# EAGLE design max128 (EAGLE 7.3.0)
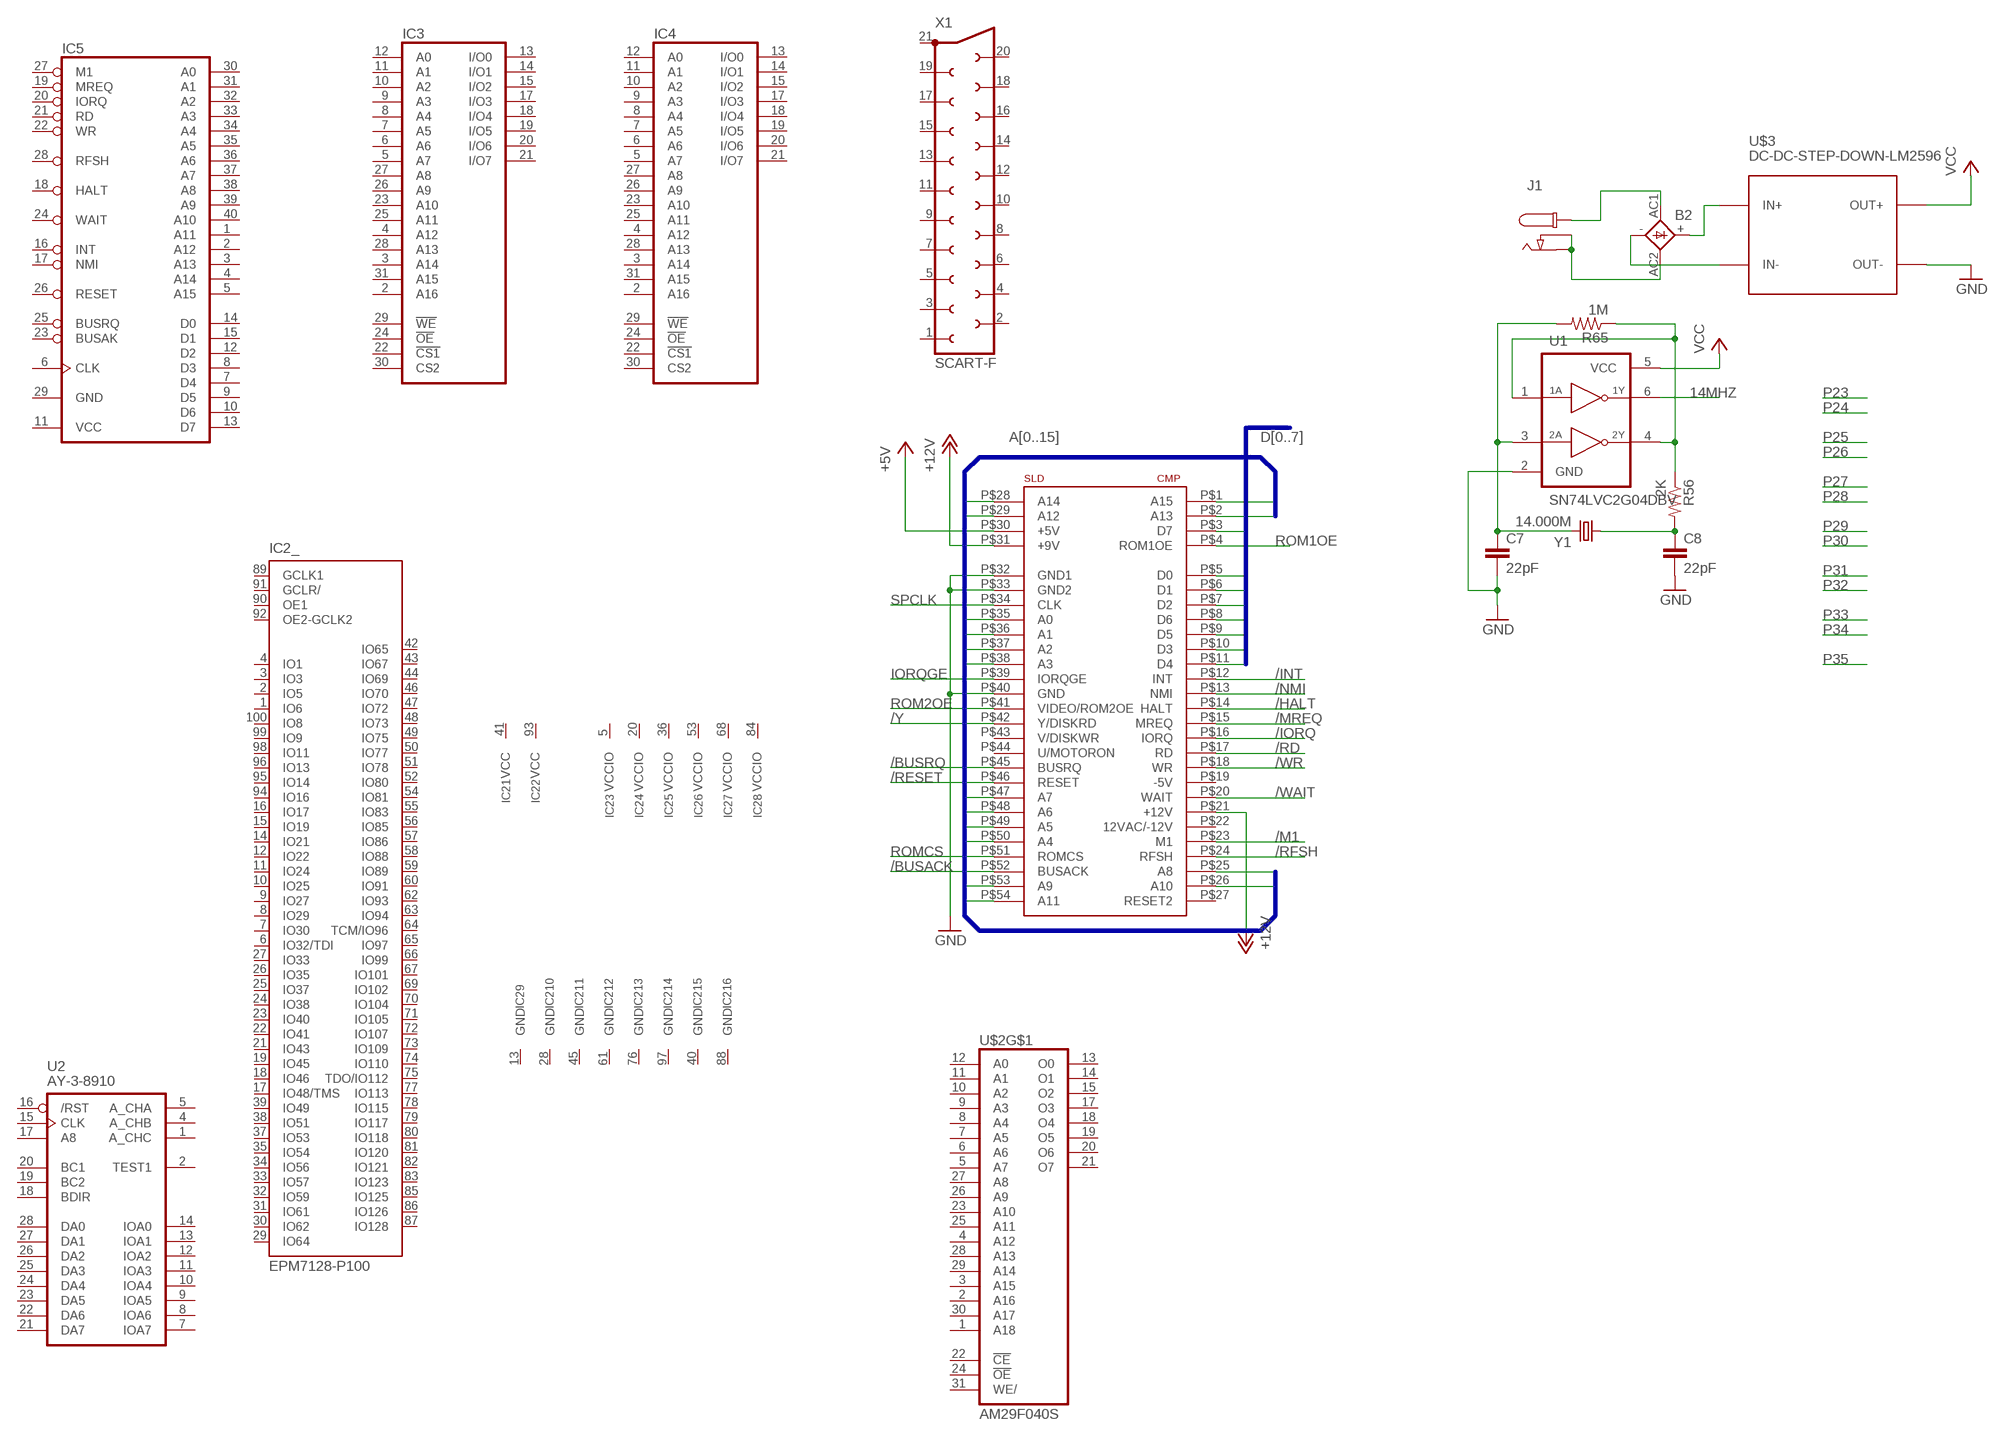
[diagram p0: schematic, sheet 1]

## Parts
B2  1KAB  [1KAB]
C7  22pF  C-EUC0805K  [C0805K]
C8  22pF  C-EUC0805K  [C0805K]
IC2  EPM7128-P100  [PQFP100]
IC3  LP621024CM  [SOP32L]
IC4  LP621024CM  [SOP32L]
IC5  Z80CPU  [DIL40]
J1  CON_DC_M-DC_PTH2  [DC_BARREL_JACK_PTH_2MM_2]
R56  2K  R-US_R0805  [R0805]
R65  1M  R-US_R0805  [R0805]
U1  SN74LVC2G04DBV  [SOT23-6]
U2  AY-3-8910  [DIL28-6]
U$1  CONECTOR_EDGE_LADO_SPECTRUM  [CONECTOR_LADO_SPECTRUM]
U$2  AM29F040S  [PLCC-SR32]
U$3  DC-DC-STEP-DOWN-LM2596  [DC-DC-STEP-DOWN-LM2596]
X1  SCART-F  [SCART-F]
Y1  14.000M  CRYSTALHC49S  [HC49/S]

## Nets
14MHZ: U1.6(1Y)
+5V [power]: U$1.P$30(+5V)
+12V [power]: U$1.P$21(+12V) U$1.P$31(+9V)
/BUSACK: U$1.P$52(BUSACK)
/BUSRQ: U$1.P$45(BUSRQ)
/HALT [power]: U$1.P$14(HALT)
/INT: U$1.P$12(INT)
/IORQ: U$1.P$16(IORQ)
/M1: U$1.P$23(M1)
/MREQ: U$1.P$15(MREQ)
/NMI: U$1.P$13(NMI)
/RD: U$1.P$17(RD)
/RESET: U$1.P$46(RESET)
/RFSH [power]: U$1.P$24(RFSH)
/WAIT: U$1.P$20(WAIT)
/WR: U$1.P$18(WR)
/Y: U$1.P$42(Y/DISKRD)
A0: U$1.P$35(A0)
A1: U$1.P$36(A1)
A2: U$1.P$37(A2)
A3: U$1.P$38(A3)
A4: U$1.P$50(A4)
A5: U$1.P$49(A5)
A6: U$1.P$48(A6)
A7: U$1.P$47(A7)
A8: U$1.P$25(A8)
A9: U$1.P$53(A9)
A10: U$1.P$26(A10)
A11: U$1.P$54(A11)
A12: U$1.P$29(A12)
A13: U$1.P$2(A13)
A14: U$1.P$28(A14)
A15: U$1.P$1(A15)
D0: U$1.P$5(D0)
D1: U$1.P$6(D1)
D2: U$1.P$7(D2)
D3: U$1.P$10(D3)
D4: U$1.P$11(D4)
D5: U$1.P$9(D5)
D6: U$1.P$8(D6)
D7: U$1.P$3(D7)
GND [power]: C7.2 C8.2 U1.2(GND) U$1.P$32(GND1) U$1.P$33(GND2) U$1.P$40(GND) U$3.OUT-
IORQGE: U$1.P$39(IORQGE)
N$1: B2.AC1 J1.P1
N$2: B2.AC2 J1.P2(P3) J1.P3(P2)
N$3: B2.+ U$3.IN+
N$4: B2.- U$3.IN-
N$24: C7.1 R65.2 U1.3(2A) Y1.2
N$27: R56.1 R65.1 U1.1(1A) U1.4(2Y)
N$61: C8.1 R56.2 Y1.1
ROM1OE: U$1.P$4(ROM1OE)
ROM2OE: U$1.P$41(VIDEO/ROM2OE)
ROMCS: U$1.P$51(ROMCS)
SPCLK: U$1.P$34(CLK)
VCC: U1.5(VCC) U$3.OUT+
Unconnected: IC2.1(_:IO6) IC2.2(_:IO5) IC2.3(_:IO3) IC2.4(_:IO1) IC2.6(_:IO32/TDI) IC2.7(_:IO30) IC2.8(_:IO29) IC2.9(_:IO27) IC2.10(_:IO25) IC2.11(_:IO24) IC2.12(_:IO22) IC2.14(_:IO21) IC2.15(_:IO19) IC2.16(_:IO17) IC2.17(_:IO48/TMS) IC2.18(_:IO46) IC2.19(_:IO45) IC2.21(_:IO43) IC2.22(_:IO41) IC2.23(_:IO40) IC2.24(_:IO38) IC2.25(_:IO37) IC2.26(_:IO35) IC2.27(_:IO33) IC2.29(_:IO64) IC2.30(_:IO62) IC2.31(_:IO61) IC2.32(_:IO59) IC2.33(_:IO57) IC2.34(_:IO56) IC2.35(_:IO54) IC2.37(_:IO53) IC2.38(_:IO51) IC2.39(_:IO49) IC2.42(_:IO65) IC2.43(_:IO67) IC2.44(_:IO69) IC2.46(_:IO70) IC2.47(_:IO72) IC2.48(_:IO73) IC2.49(_:IO75) IC2.50(_:IO77) IC2.51(_:IO78) IC2.52(_:IO80) IC2.54(_:IO81) IC2.55(_:IO83) IC2.56(_:IO85) IC2.57(_:IO86) IC2.58(_:IO88) IC2.59(_:IO89) IC2.60(_:IO91) IC2.62(_:IO93) IC2.63(_:IO94) IC2.64(_:TCM/IO96) IC2.65(_:IO97) IC2.66(_:IO99) IC2.67(_:IO101) IC2.69(_:IO102) IC2.70(_:IO104) IC2.71(_:IO105) IC2.72(_:IO107) IC2.73(_:IO109) IC2.74(_:IO110) IC2.75(_:TDO/IO112) IC2.77(_:IO113) IC2.78(_:IO115) IC2.79(_:IO117) IC2.80(_:IO118) IC2.81(_:IO120) IC2.82(_:IO121) IC2.83(_:IO123) IC2.85(_:IO125) IC2.86(_:IO126) IC2.87(_:IO128) IC2.89(_:GCLK1) IC2.90(_:OE1) IC2.91(_:GCLR/) IC2.92(_:OE2-GCLK2) IC2.94(_:IO16) IC2.95(_:IO14) IC2.96(_:IO13) IC2.98(_:IO11) IC2.99(_:IO9) IC2.100(_:IO8) IC3.1(NC) IC3.2(A16) IC3.3(A14) IC3.4(A12) IC3.5(A7) IC3.6(A6) IC3.7(A5) IC3.8(A4) IC3.9(A3) IC3.10(A2) IC3.11(A1) IC3.12(A0) IC3.13(I/O0) IC3.14(I/O1) IC3.15(I/O2) IC3.17(I/O3) IC3.18(I/O4) IC3.19(I/O5) IC3.20(I/O6) IC3.21(I/O7) IC3.22(!CS1) IC3.23(A10) IC3.24(!OE) IC3.25(A11) IC3.26(A9) IC3.27(A8) IC3.28(A13) IC3.29(!WE) IC3.30(CS2) IC3.31(A15) IC4.1(NC) IC4.2(A16) IC4.3(A14) IC4.4(A12) IC4.5(A7) IC4.6(A6) IC4.7(A5) IC4.8(A4) IC4.9(A3) IC4.10(A2) IC4.11(A1) IC4.12(A0) IC4.13(I/O0) IC4.14(I/O1) IC4.15(I/O2) IC4.17(I/O3) IC4.18(I/O4) IC4.19(I/O5) IC4.20(I/O6) IC4.21(I/O7) IC4.22(!CS1) IC4.23(A10) IC4.24(!OE) IC4.25(A11) IC4.26(A9) IC4.27(A8) IC4.28(A13) IC4.29(!WE) IC4.30(CS2) IC4.31(A15) IC5.1(A11) IC5.2(A12) IC5.3(A13) IC5.4(A14) IC5.5(A15) IC5.6(CLK) IC5.7(D4) IC5.8(D3) IC5.9(D5) IC5.10(D6) IC5.12(D2) IC5.13(D7) IC5.14(D0) IC5.15(D1) IC5.16(INT) IC5.17(NMI) IC5.18(HALT) IC5.19(MREQ) IC5.20(IORQ) IC5.21(RD) IC5.22(WR) IC5.23(BUSAK) IC5.24(WAIT) IC5.25(BUSRQ) IC5.26(RESET) IC5.27(M1) IC5.28(RFSH) IC5.30(A0) IC5.31(A1) IC5.32(A2) IC5.33(A3) IC5.34(A4) IC5.35(A5) IC5.36(A6) IC5.37(A7) IC5.38(A8) IC5.39(A9) IC5.40(A10) U2.1(A_CHC) U2.2(TEST1) U2.4(A_CHB) U2.5(A_CHA) U2.7(IOA7) U2.8(IOA6) U2.9(IOA5) U2.10(IOA4) U2.11(IOA3) U2.12(IOA2) U2.13(IOA1) U2.14(IOA0) U2.15(CLK) U2.16(/RST) U2.17(A8) U2.18(BDIR) U2.19(BC2) U2.20(BC1) U2.21(DA7) U2.22(DA6) U2.23(DA5) U2.24(DA4) U2.25(DA3) U2.26(DA2) U2.27(DA1) U2.28(DA0) U$1.P$19(-5V) U$1.P$22(12VAC/-12V) U$1.P$27(RESET2) U$1.P$43(V/DISKWR) U$1.P$44(U/MOTORON) U$2.1(A18) U$2.2(A16) U$2.3(A15) U$2.4(A12) U$2.5(A7) U$2.6(A6) U$2.7(A5) U$2.8(A4) U$2.9(A3) U$2.10(A2) U$2.11(A1) U$2.12(A0) U$2.13(O0) U$2.14(O1) U$2.15(O2) U$2.17(O3) U$2.18(O4) U$2.19(O5) U$2.20(O6) U$2.21(O7) U$2.22(!CE) U$2.23(A10) U$2.24(!OE) U$2.25(A11) U$2.26(A9) U$2.27(A8) U$2.28(A13) U$2.29(A14) U$2.30(A17) U$2.31(WE/) X1.1 X1.2 X1.3 X1.4 X1.5 X1.6 X1.7 X1.8 X1.9 X1.10 X1.11 X1.12 X1.13 X1.14 X1.15 X1.16 X1.17 X1.18 X1.19 X1.20 X1.21

## Buses
D[0..7]
A[0..15]

## Power pins joined to a net without a drawn wire
GND: IC2.13(9:GND) IC2.28(10:GND) IC2.40(15:GND) IC2.45(11:GND) IC2.61(12:GND) IC2.76(13:GND) IC2.88(16:GND) IC2.97(14:GND) IC3.16(GND) IC4.16(GND) IC5.29(GND) U2.6(GND) U$2.16(GND)
VCC: IC2.41(1:VCC) IC2.93(2:VCC) IC3.32(VCC) IC4.32(VCC) IC5.11(VCC) U2.3(VCC) U$2.32(VCC)
VCCIO: IC2.5(3:VCCIO) IC2.20(4:VCCIO) IC2.36(5:VCCIO) IC2.53(6:VCCIO) IC2.68(7:VCCIO) IC2.84(8:VCCIO)

## Library data of the parts
B2 = rectifier:1KAB: RECTIFIER grid 5,08 x 5,08 mm
C7 C8 = rcl:C-EU: CAPACITOR, European symbol
IC2 = altera:EPM7128-?100: EPM70128 MAX 7000 family; MPN: EPM7128SQC100-7N; OC_FARNELL: 1549424; OC_NEWARK: 51R0530
IC3 IC4 = memory:LP621024CM: MEMORY
IC5 = zilog:Z80CPU: Z80 FAMILY DEVICE
J1 = dp_devices:CON_DC_M: DC power connector
R56 R65 = rcl:R-US_: RESISTOR, American symbol
U1 = 74LV:SN74LVC2G04: DUAL INVERTER GATE
U2 = oldchips:AY-3-8910: Programmable sound generator
U$1 = zx_spectrum:CONECTOR_EDGE_LADO_SPECTRUM
U$2 = am29-memory:AM29F040S
U$3 = diy-modules:DC-DC-STEP-DOWN-LM2596: DC/DC Step-Down Regulator based on LM2596-ADJ chip LM2596 datasheet available here: http://www.ti.com/lit/ds/symlink/lm2596.pdf Click here to find device on ebay.com <http://www.ebay.com/sch/lm2596+power+regulator>
X1 = con-hirschmann:SCART-F: TV SCART CONNECTOR; OC_FARNELL: unknown; OC_NEWARK: unknown
Y1 = crystal:CRYSTAL: CRYSTAL; OC_FARNELL: 1667008; OC_NEWARK: unknown

## Net classes
1 power: width 0.305 mm, clearance 0.178 mm to class 0, clearance 0.229 mm

## Board
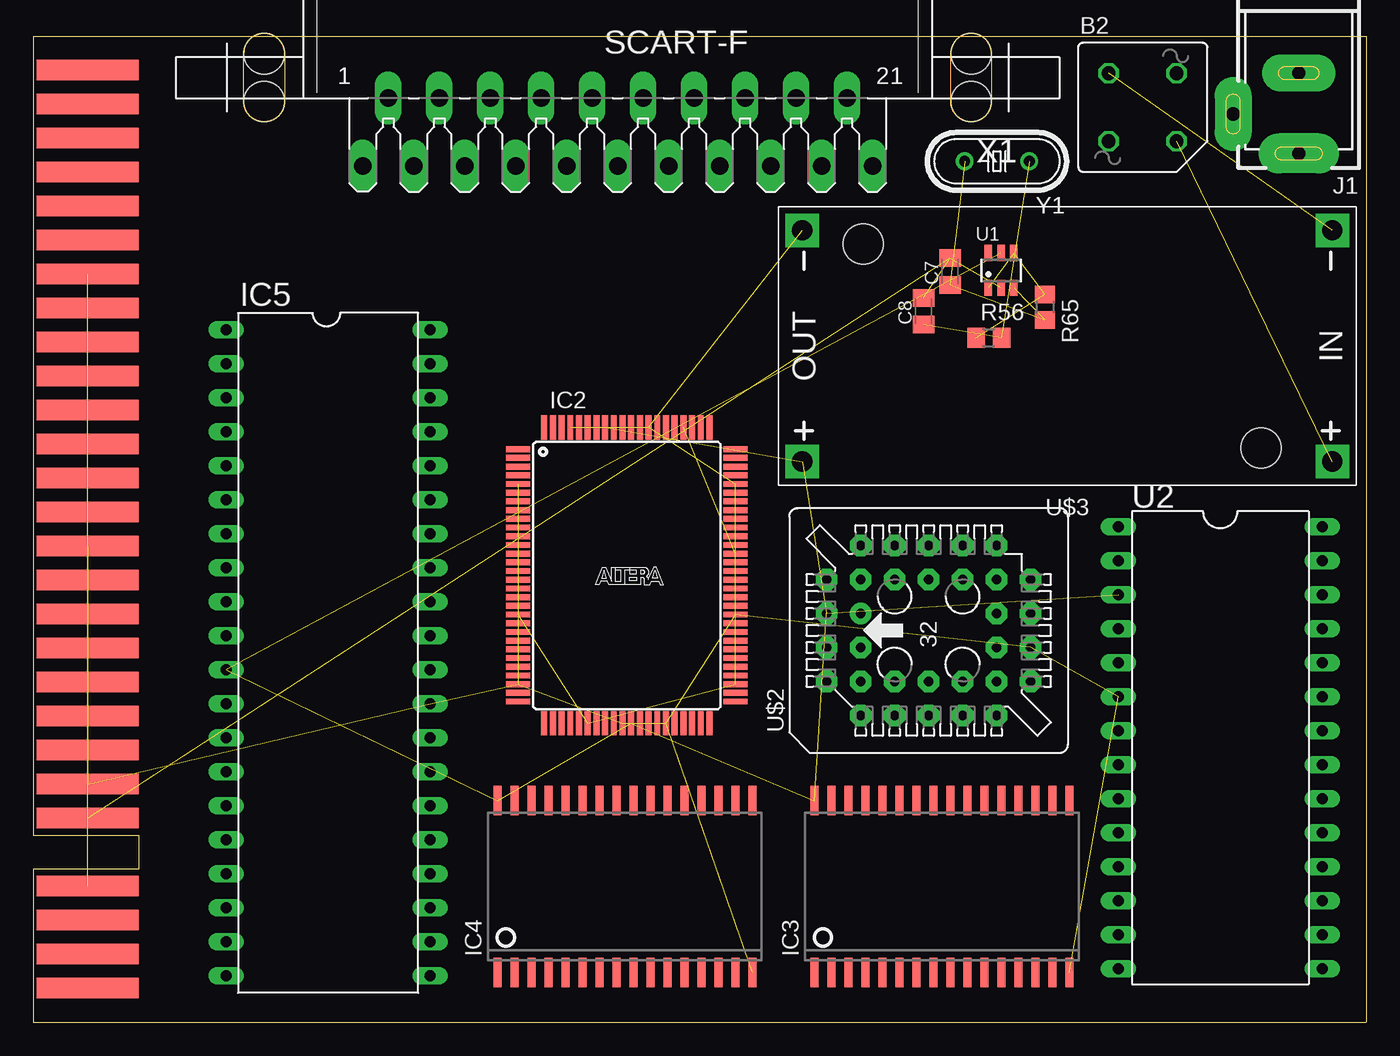
[diagram p1: board, top side]
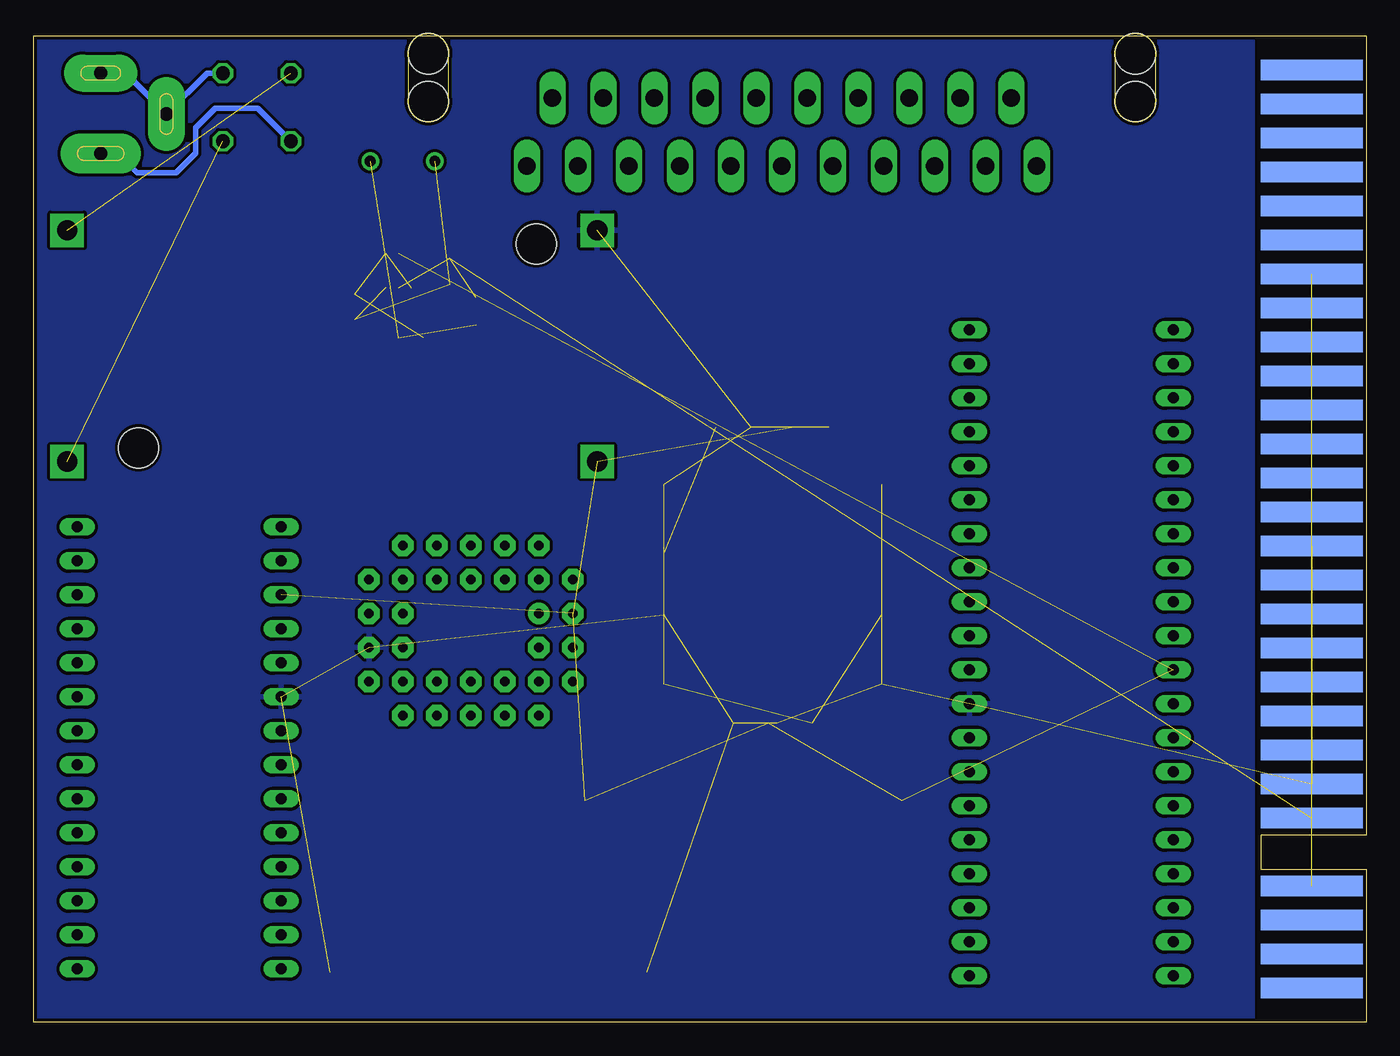
[diagram p2: board, bottom side, seen from below]

Size 99.59 x 73.86 mm. Coordinates in mm from the lower left corner, seen from the top.
Outline: 0,0 99.57,0
Outline: 0,73.66 99.59,73.66 99.59,0
Copper layers (1*16): Top 0.035mm / dielectric 1.5mm / Bottom 0.035mm
Design rules "dirt_cheap_dirty_boards.v1": minimum track width 5mil, minimum drill 12mil, track to track 5mil, track to pad 5mil, pad to pad 5mil, via to via 5mil, smd to smd 0mil, copper to edge 10mil, drill to drill 10mil, minimum pad ring 10mil, minimum via ring 6mil, stop-mask expansion 2mil, vias tented up to drill 25mil, thermal gap 10mil

### Footprints (pad centres in the part's own frame; a part is rotated, then mirrored left to right if it is on the bottom)
1KAB = drill 1.016 octagon: + 2.54,-2.54; - -2.54,2.54; AC1 -2.54,-2.54; AC2 2.54,2.54
C0805K = smd 1.3 x 1.6: 1 -1,0; 2 1,0
PQFP100 = smd 1.8 x 0.44: 1 -8.125,9.425; 2 -8.125,8.775; 3 -8.125,8.125; 4 -8.125,7.475; 5 -8.125,6.825; 6 -8.125,6.175; 7 -8.125,5.525; 8 -8.125,4.875; 9 -8.125,4.225; 10 -8.125,3.575; 11 -8.125,2.925; 12 -8.125,2.275; 13 -8.125,1.625; 14 -8.125,0.975; 15 -8.125,0.325; 16 -8.125,-0.325; 17 -8.125,-0.975; 18 -8.125,-1.625; 19 -8.125,-2.275; 20 -8.125,-2.925; 21 -8.125,-3.575; 22 -8.125,-4.225; 23 -8.125,-4.875; 24 -8.125,-5.525; 25 -8.125,-6.175; 26 -8.125,-6.825; 27 -8.125,-7.475; 28 -8.125,-8.125; 29 -8.125,-8.775; 30 -8.125,-9.425; 51 8.125,-9.425; 52 8.125,-8.775; 53 8.125,-8.125; 54 8.125,-7.475; 55 8.125,-6.825; 56 8.125,-6.175; 57 8.125,-5.525; 58 8.125,-4.875; 59 8.125,-4.225; 60 8.125,-3.575; 61 8.125,-2.925; 62 8.125,-2.275; 63 8.125,-1.625; 64 8.125,-0.975; 65 8.125,-0.325; 66 8.125,0.325; 67 8.125,0.975; 68 8.125,1.625; 69 8.125,2.275; 70 8.125,2.925; 71 8.125,3.575; 72 8.125,4.225; 73 8.125,4.875; 74 8.125,5.525; 75 8.125,6.175; 76 8.125,6.825; 77 8.125,7.475; 78 8.125,8.125; 79 8.125,8.775; 80 8.125,9.425 | smd 0.44 x 1.8: 31 -6.175,-11.05; 32 -5.525,-11.05; 33 -4.875,-11.05; 34 -4.225,-11.05; 35 -3.575,-11.05; 36 -2.925,-11.05; 37 -2.275,-11.05; 38 -1.625,-11.05; 39 -0.975,-11.05; 40 -0.325,-11.05; 41 0.325,-11.05; 42 0.975,-11.05; 43 1.625,-11.05; 44 2.275,-11.05; 45 2.925,-11.05; 46 3.575,-11.05; 47 4.225,-11.05; 48 4.875,-11.05; 49 5.525,-11.05; 50 6.175,-11.05; 81 6.175,11.05; 82 5.525,11.05; 83 4.875,11.05; 84 4.225,11.05; 85 3.575,11.05; 86 2.925,11.05; 87 2.275,11.05; 88 1.625,11.05; 89 0.975,11.05; 90 0.325,11.05; 91 -0.325,11.05; 92 -0.975,11.05; 93 -1.625,11.05; 94 -2.275,11.05; 95 -2.925,11.05; 96 -3.575,11.05; 97 -4.225,11.05; 98 -4.875,11.05; 99 -5.525,11.05; 100 -6.175,11.05
SOP32L = smd 0.6 x 2.2: 1 -9.525,-6.416; 2 -8.255,-6.416; 3 -6.985,-6.416; 4 -5.715,-6.416; 5 -4.445,-6.416; 6 -3.175,-6.416; 7 -1.905,-6.416; 8 -0.635,-6.416; 9 0.635,-6.416; 10 1.905,-6.416; 11 3.175,-6.416; 12 4.445,-6.416; 13 5.715,-6.416; 14 6.985,-6.416; 15 8.255,-6.416; 16 9.525,-6.416; 17 9.525,6.416; 18 8.255,6.416; 19 6.985,6.416; 20 5.715,6.416; 21 4.445,6.416; 22 3.175,6.416; 23 1.905,6.416; 24 0.635,6.416; 25 -0.635,6.416; 26 -1.905,6.416; 27 -3.175,6.416; 28 -4.445,6.416; 29 -5.715,6.416; 30 -6.985,6.416; 31 -8.255,6.416; 32 -9.525,6.416
DIL40 = drill 0.813 long: 1 -24.13,-7.62; 2 -21.59,-7.62; 3 -19.05,-7.62; 4 -16.51,-7.62; 5 -13.97,-7.62; 6 -11.43,-7.62; 7 -8.89,-7.62; 8 -6.35,-7.62; 9 -3.81,-7.62; 10 -1.27,-7.62; 11 1.27,-7.62; 12 3.81,-7.62; 13 6.35,-7.62; 14 8.89,-7.62; 15 11.43,-7.62; 16 13.97,-7.62; 17 16.51,-7.62; 18 19.05,-7.62; 19 21.59,-7.62; 20 24.13,-7.62; 21 24.13,7.62; 22 21.59,7.62; 23 19.05,7.62; 24 16.51,7.62; 25 13.97,7.62; 26 11.43,7.62; 27 8.89,7.62; 28 6.35,7.62; 29 3.81,7.62; 30 1.27,7.62; 31 -1.27,7.62; 32 -3.81,7.62; 33 -6.35,7.62; 34 -8.89,7.62; 35 -11.43,7.62; 36 -13.97,7.62; 37 -16.51,7.62; 38 -19.05,7.62; 39 -21.59,7.62; 40 -24.13,7.62
DC_BARREL_JACK_PTH_2MM_2 = drill 1 pad 3 long: P1 0,5.205 | drill 1 pad 2.75 long: P2 4.9,2.255; P3 0,-0.795
R0805 = smd 1.3 x 1.5: 1 -0.95,0; 2 0.95,0
SOT23-6 = smd 0.55 x 1.2: 1 -0.95,-1.3; 2 0,-1.3; 3 0.95,-1.3; 4 0.95,1.3; 5 0,1.3; 6 -0.95,1.3
DIL28-6 = drill 0.813 long: 1 -16.51,-7.62; 2 -13.97,-7.62; 3 -11.43,-7.62; 4 -8.89,-7.62; 5 -6.35,-7.62; 6 -3.81,-7.62; 7 -1.27,-7.62; 8 1.27,-7.62; 9 3.81,-7.62; 10 6.35,-7.62; 11 8.89,-7.62; 12 11.43,-7.62; 13 13.97,-7.62; 14 16.51,-7.62; 15 16.51,7.62; 16 13.97,7.62; 17 11.43,7.62; 18 8.89,7.62; 19 6.35,7.62; 20 3.81,7.62; 21 1.27,7.62; 22 -1.27,7.62; 23 -3.81,7.62; 24 -6.35,7.62; 25 -8.89,7.62; 26 -11.43,7.62; 27 -13.97,7.62; 28 -16.51,7.62
CONECTOR_LADO_SPECTRUM = smd 7.62 x 1.524: P$1 2.54,2.54; P$2 2.54,0; P$3 2.54,-2.54; P$4 2.54,-5.08; P$5 2.54,-10.16; P$6 2.54,-12.7; P$7 2.54,-15.24; P$8 2.54,-17.78; P$9 2.54,-20.32; P$10 2.54,-22.86; P$11 2.54,-25.4; P$12 2.54,-27.94; P$13 2.54,-30.48; P$14 2.54,-33.02; P$15 2.54,-35.56; P$16 2.54,-38.1; P$17 2.54,-40.64; P$18 2.54,-43.18; P$19 2.54,-45.72; P$20 2.54,-48.26; P$21 2.54,-50.8; P$22 2.54,-53.34; P$23 2.54,-55.88; P$24 2.54,-58.42; P$25 2.54,-60.96; P$26 2.54,-63.5; P$27 2.54,-66.04 | smd 7.62 x 1.524 bottom: P$28 2.54,2.54; P$29 2.54,0; P$30 2.54,-2.54; P$31 2.54,-5.08; P$32 2.54,-10.16; P$33 2.54,-12.7; P$34 2.54,-15.24; P$35 2.54,-17.78; P$36 2.54,-20.32; P$37 2.54,-22.86; P$38 2.54,-25.4; P$39 2.54,-27.94; P$40 2.54,-30.48; P$41 2.54,-33.02; P$42 2.54,-35.56; P$43 2.54,-38.1; P$44 2.54,-40.64; P$45 2.54,-43.18; P$46 2.54,-45.72; P$47 2.54,-48.26; P$48 2.54,-50.8; P$49 2.54,-53.34; P$50 2.54,-55.88; P$51 2.54,-58.42; P$52 2.54,-60.96; P$53 2.54,-63.5; P$54 2.54,-66.04
PLCC-SR32 = drill 0.7 pad 1.6: 1 1.27,5.08 | drill 0.7 pad 1.6 octagon: 2 -1.27,7.62; 3 -1.27,5.08; 4 -3.81,7.62; 5 -6.35,5.08; 6 -3.81,5.08; 7 -6.35,2.54; 8 -3.81,2.54; 9 -6.35,0; 10 -3.81,0; 11 -6.35,-2.54; 12 -3.81,-2.54; 13 -6.35,-5.08; 14 -3.81,-7.62; 15 -3.81,-5.08; 16 -1.27,-7.62; 17 -1.27,-5.08; 18 1.27,-7.62; 19 1.27,-5.08; 20 3.81,-7.62; 21 6.35,-5.08; 22 3.81,-5.08; 23 6.35,-2.54; 24 3.81,-2.54; 25 6.35,0; 26 3.81,0; 27 6.35,2.54; 28 3.81,2.54; 29 6.35,5.08; 30 3.81,7.62; 31 3.81,5.08; 32 1.27,7.62
DC-DC-STEP-DOWN-LM2596 = drill 1.5 pad 2.5 square: IN+ -19.812,8.636; IN- -19.812,-8.636; OUT+ 19.812,8.636; OUT- 19.812,-8.636 | hole 3: -14.478,7.62; 15.24,-7.62
SCART-F = drill 1.321 long: 1 19.05,5.08; 2 17.145,0; 3 15.24,5.08; 4 13.335,0; 5 11.43,5.08; 6 9.525,0; 7 7.62,5.08; 8 5.715,0; 9 3.81,5.08; 10 1.905,0; 11 0,5.08; 12 -1.905,0; 13 -3.81,5.08; 14 -5.715,0; 15 -7.62,5.08; 16 -9.525,0; 17 -11.43,5.08; 18 -13.335,0; 19 -15.24,5.08; 20 -17.145,0; 21 -19.05,5.08 | hole 3.023: 26.416,0.254; 26.416,-3.302; -26.416,0.254; -26.416,-3.302
HC49/S = drill 0.813: 1 -2.413,0; 2 2.413,0

### Placement (x,y rotation side)
B2  82.91,68.35 0 top
C7  68.5,56.08 90 top
C8  66.52,53.11 90 top
IC2  44.35,33.38 0 top
IC3  67.89,10.13 0 top
IC4  44.2,10.13 0 top
IC5  22.02,27.58 270 top
J1  94.56,70.1 180 top
R56  71.4,51.13 0 top
R65  75.59,53.42 270 top
U1  72.31,56.16 0 top
U2  88.7,20.5 270 top
U$1  6.6,5.08 180 top
U$2  66.9,29.26 90 top
U$3  77.27,50.52 180 top
X1  43.66,69.04 180 top
Y1  72.01,64.31 180 top

### Tracks (layer width: path | path; a pad name or v marks a point on that pad's centre or on a via)
+12V  (1 unrouted)
GND  (19 unrouted)
  pour Bottom: 8.51,0.38 8.51,73.28 99.21,73.28 99.21,0.38
N$1
  Bottom 0.406: J1.P1 93.25,64.9 91.82,63.48 88.92,63.48 87.48,64.92 87.48,66.83 86.03,68.28 82.83,68.28 B2.AC1
N$2
  Bottom 0.406: J1.P3 92.71,70.9 J1.P2 86.62,70.89 B2.AC2
N$3  (1 unrouted)
N$4  (1 unrouted)
N$24  (3 unrouted)
N$27  (3 unrouted)
N$61  (2 unrouted)
VCC  (8 unrouted)
VCCIO  (5 unrouted)